# EAGLE design SkyKontrol-powerMeter (EAGLE 9.5.2)
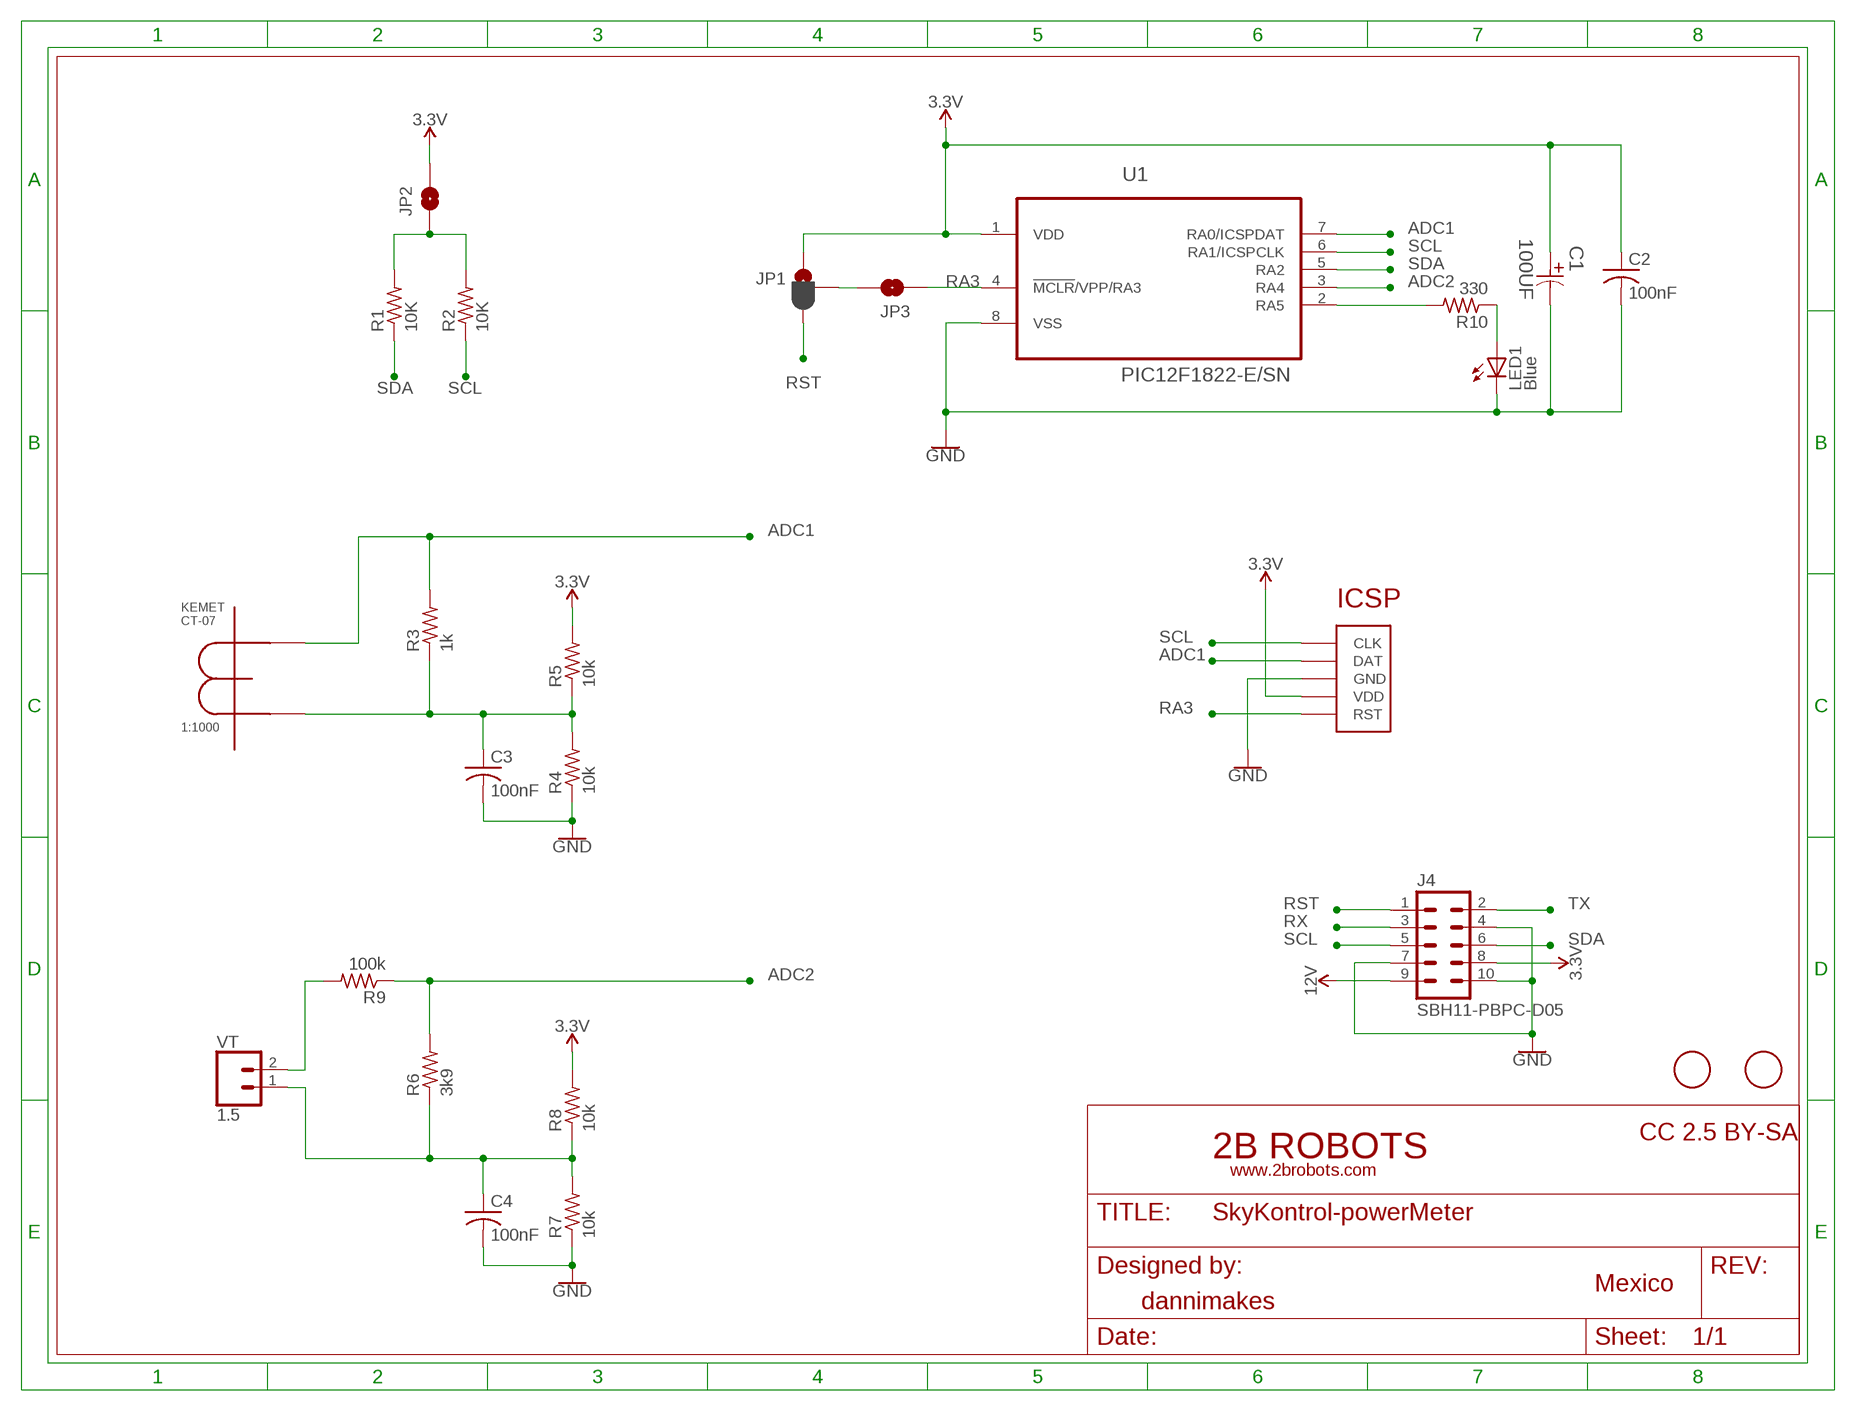
[diagram p0: schematic, sheet 1]

## Parts
C1  100UF  EEE-HA1E101XP-CASE-D8  [CAPAE660X800N]
C2  100nF  C-USC0603K  [C0603K]
C3  100nF  C-USC0603K  [C0603K]
C4  100nF  C-USC0603K  [C0603K]
J4  SBH11-PBPC-D05  [SBH11-PBPC-D05]
JP1  JUMPER-SMT_3_1-NC_PASTE_SILK  [SMT-JUMPER_3_1-NC_PASTE_SILK]
JP2  JUMPER-SMT_2_NO_SILK  [SMT-JUMPER_2_NO_SILK]
JP3  JUMPER-SMT_2_NO_SILK  [SMT-JUMPER_2_NO_SILK]
LED1  Blue  LEDCHIPLED_1206  [CHIPLED_1206]
R1  10K  R-US_R0805  [R0805]
R2  10K  R-US_R0805  [R0805]
R3  1k  R-US_R0805  [R0805]
R4  10k  R-US_R0805  [R0805]
R5  10k  R-US_R0805  [R0805]
R6  3k9  R-US_R0805  [R0805]
R7  10k  R-US_R0805  [R0805]
R8  10k  R-US_R0805  [R0805]
R9  100k  R-US_R0805  [R0805]
R10  330  R-US_R0805  [R0805]
U1  PIC12F1822-E/SN  [SOIC127P600X175-8N]
U$1  FIDUCIAL  [FIDUCIAL_1MM]
U$2  ICSP_POGO  [ICSP_POGO]
U$3  FIDUCIAL  [FIDUCIAL_1MM]
U$4  CT-07KEMET  [CT-07]
VT  1.5  CONN_025MM  [SCREWTERMINAL-5MM-2]

## Nets
3.3V: C1.1 C2.1 J4.8 JP1.1 JP2.2 R5.2 R8.2 U1.1(VDD) U$2.P$2(VDD)
12V: J4.9
ADC1: R3.2 U1.7(RA0/ICSPDAT) U$2.P$4(DAT) U$4.P$1(C1)
ADC2: R6.2 R9.1 U1.3(RA4)
GND: C1.2 C2.2 C3.2 C4.2 J4.4 J4.7 J4.10 LED1.C R4.1 R7.1 U1.8(VSS) U$2.P$3(GND)
N$1: JP1.2 JP3.2
N$2: C3.1 R3.1 R4.2 R5.1 U$4.P$2(C2)
N$3: R9.2 VT.2
N$4: C4.1 R6.1 R7.2 R8.1 VT.1
N$8: JP2.1 R1.2 R2.2
N$9: R10.2 U1.2(RA5)
N$10: LED1.A R10.1
RA3: JP3.1 U1.4(!MCLR!/VPP/RA3) U$2.P$1(RST)
RST: J4.1 JP1.3
RX: J4.3
SCL: J4.5 R2.1 U1.6(RA1/ICSPCLK) U$2.P$5(CLK)
SDA: J4.6 R1.1 U1.5(RA2)
TX: J4.2

## Library data of the parts
C1 = Panasonic-EEEFT_EEEH:EEE-: Aluminum Electrolytic Capacitors,Surface Mount Type; MPN: EEE-HA1E101XP; OC_FARNELL: 1973328; OC_NEWARK: 58T9236; PACKAGE: CASE-D8; SUPPLIER: PANASONIC; TOLERANCE: ±20 %; VOLTAGERATING: 25V
C2-C4 = adafruit:C-US: CAPACITOR, American symbol
J4 = con-sullins:SBH11-PBPC-D05: HEADER - Vertical, Shrouded
JP1 = SparkFun-Jumpers:JUMPER-SMT_3_1-NC_PASTE: Normally closed solder jumper (1 of 2 connections) This jumper has an aperture in the stencil to allow solder paste to bridge one of the two connections. One connection is normally closed (NC), while the other is normally open (NO). Wick off the solder to open the connection. Reapply solder to reclose the connection. Apply solder to the other side instead to change the current path.
JP2 JP3 = SparkFun-Jumpers:JUMPER-SMT_2_NO: Normally open jumper This jumper has two pads in close proximity to each other. Apply solder to close the connection. Round pads are easier to solder for beginners, but are a lot larger. SparkFun Product that uses the round pads: SparkFun EL Sequencer <https://www.sparkfun.com/products/12781>
LED1 = adafruit:LED: LED OSRAM: - CHIPLED LG R971, LG N971, LY N971, LG Q971, LY Q971, LO R971, LY R971 LH N974, LH R974 LS Q976, LO Q976, LY Q976 LO Q996 - Hyper CHIPLED LW Q18S LB Q993, LB Q99A, LB R99A - SideLED LS A670, LO A670, LY A670, LG A670, LP A670 LB A673, LV A673, LT A673, LW A673 LH A674 LY A675 LS A676, LA A676, LO A676, LY A676, LW A676 LS A679, LY A679, LG A679 - Hyper Micro SIDELED® LS Y876, LA Y876, LO Y876, LY Y876 LT Y87S - SmartLED LW L88C, LW L88S LB L89C, LB L89S, LG L890 LS L89K, LO L89K, LY L89K LS L896, LA L896, LO L896, LY L896 - TOPLED LS T670, LO T670, LY T670, LG T670, LP T670 LSG T670, LSP T670, LSY T670, LOP T670, LYG T670 LG T671, LOG T671, LSG T671 LB T673, LV T673, LT T673, LW T673 LH T674 LS T676, LA T676, LO T676, LY T676, LB T676, LH T676, LSB T676, LW T676 LB T67C, LV T67C, LT T67C, LS T67K, LO T67K, LY T67K, LW E67C LS E67B, LA E67B, LO E67B, LY E67B, LB E67C, LV E67C, LT E67C LW T67C LS T679, LY T679, LG T679 LS T770, LO T770, LY T770, LG T770, LP T770 LB T773, LV T773, LT T773, LW T773 LH T774 LS E675, LA E675, LY E675, LS T675 LS T776, LA T776, LO T776, LY T776, LB T776 LHGB T686 LT T68C, LB T68C - Hyper Mini TOPLED® LB M676 - Mini TOPLED Santana® LG M470 LS M47K, LO M47K, LY M47K Source: http://www.osram.convergy.de/
R1-R10 = adafruit:R-US_: RESISTOR, American symbol
U1 = Microchip-PIC12F1822-E_SN:PIC12F1822-E/SN: 8/14-Pin Flash Microcontrollers,SOIC-8; MPN: PIC12F1822-E/SN; OC_FARNELL: 2315760; OC_NEWARK: 53R0195; PACKAGE: SOIC-8; SUPPLIER: Microchip
U$1 U$3 = adafruit:FIDUCIAL: For use by pick and place machines to calibrate the vision/machine, 1mm By microbuilder.eu
U$2 = ICSP_POGO:ICSP_POGO
U$4 = CT-07:CT-07: The Kemet CT series low-alternating current sensors can be used to detect very low current levels and for overcurrent protection in electronic appliances. Typical applications include overcurrent detection in microcontroller-based equipment, refrigerators, air conditioners, inductive heating, servo motors, inverters, UPSs and SMPS.; CT-07: 1:1000
VT = SparkFun-Connectors:CONN_02: Multi connection point. Often used as Generic Header-pin footprint for 0.1 inch spaced/style header connections On any of the 0.1 inch spaced packages, you can populate with these: Break Away Headers - Straight <https://www.sparkfun.com/products/116> (PRT-00116) Break Away Male Headers - Right Angle <https://www.sparkfun.com/products/553> (PRT-00553) Female Headers <https://www.sparkfun.com/products/115> (PRT-00115) Break Away Headers - Machine Pin <https://www.sparkfun.com/products/117> (PRT-00117) Break Away Female Headers - Swiss Machine Pin <https://www.sparkfun.com/products/743> (PRT-00743) For SCREWTERMINALS and SPRING TERMINALS visit here: Screw Terimnals on SparkFun.com <https://www.sparkfun.com/search/results?term=Screw+Terminals> (5mm/3.5mm/2.54mm spacing) This device is also useful as a general connection point to wire up your design to another part of your project. Our various solder wires solder well into these plated through hole pads. Hook-Up Wire - Assortment (Stranded, 22 AWG) <https://www.sparkfun.com/products/11375> (PRT-11375) Hook-Up Wire - Assortment (Solid Core, 22 AWG) <https://www.sparkfun.com/products/11367> (PRT-11367) View the entire wire category on our website here <https://www.sparkfun.com/categories/141> Special notes: Molex polarized connector foot print use with: PRT-08233 with associated crimp pins and housings. 2.54_SCREWTERM for use with PRT-10571. 3.5mm Screw Terminal footprints for PRT-08084 5mm Screw Terminal footprints for use with PRT-08432; SF_SKU: PRT-08432

## Board
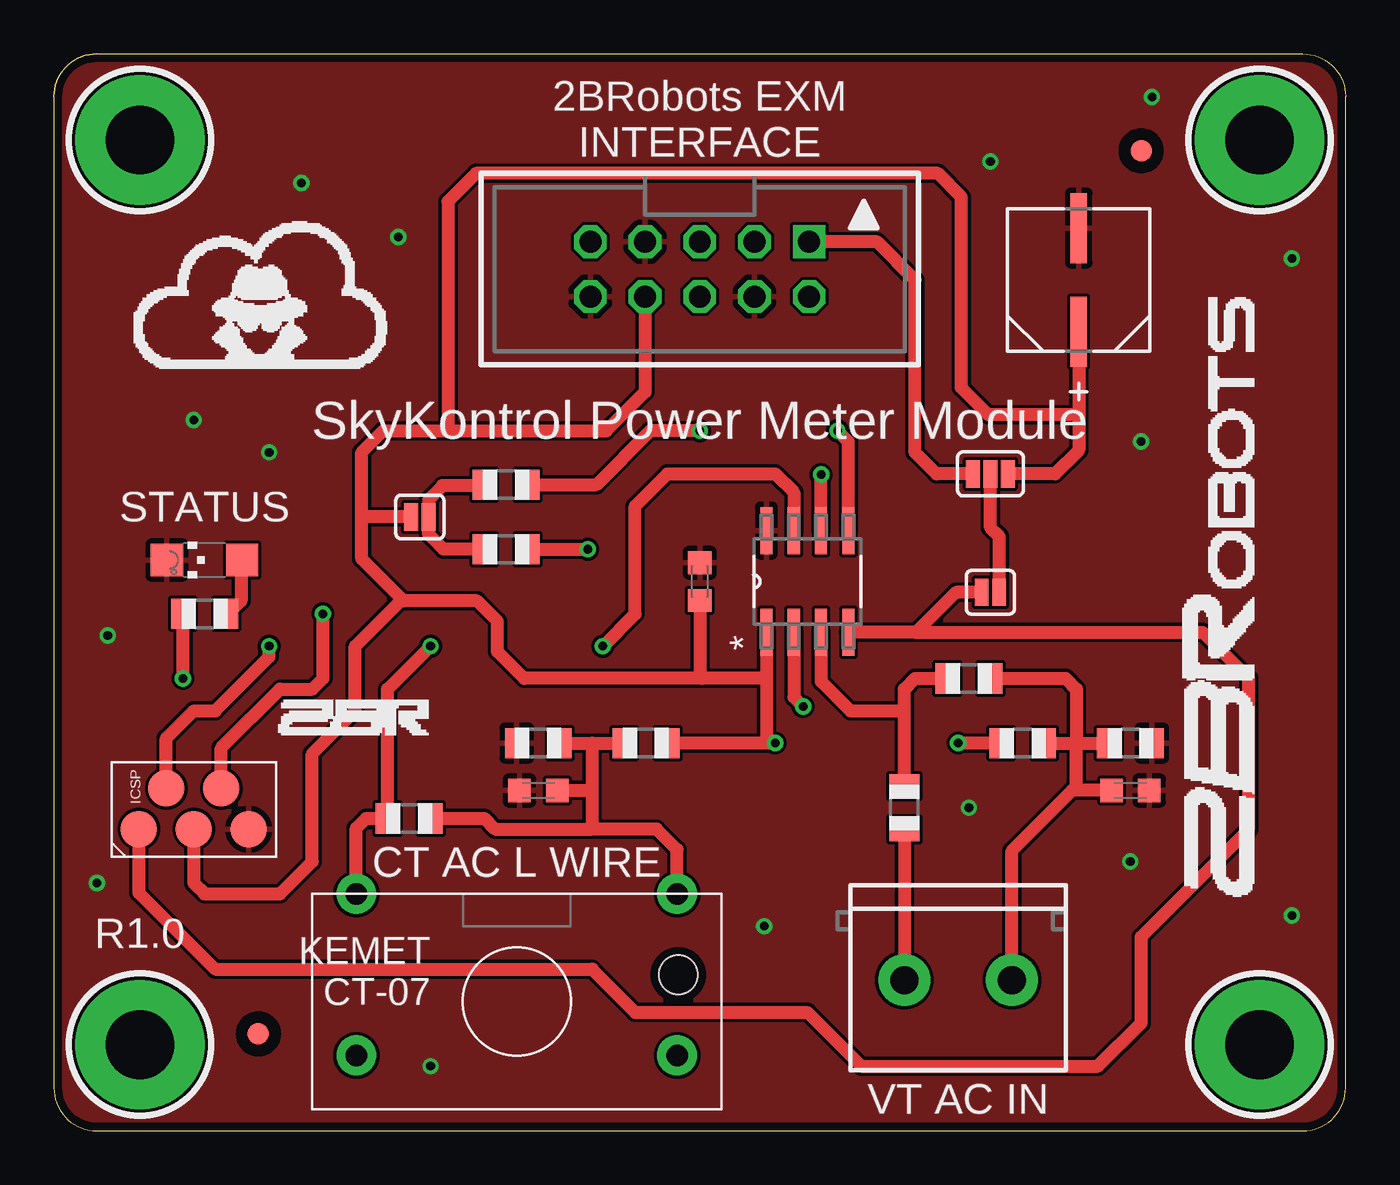
[diagram p1: board, top side]
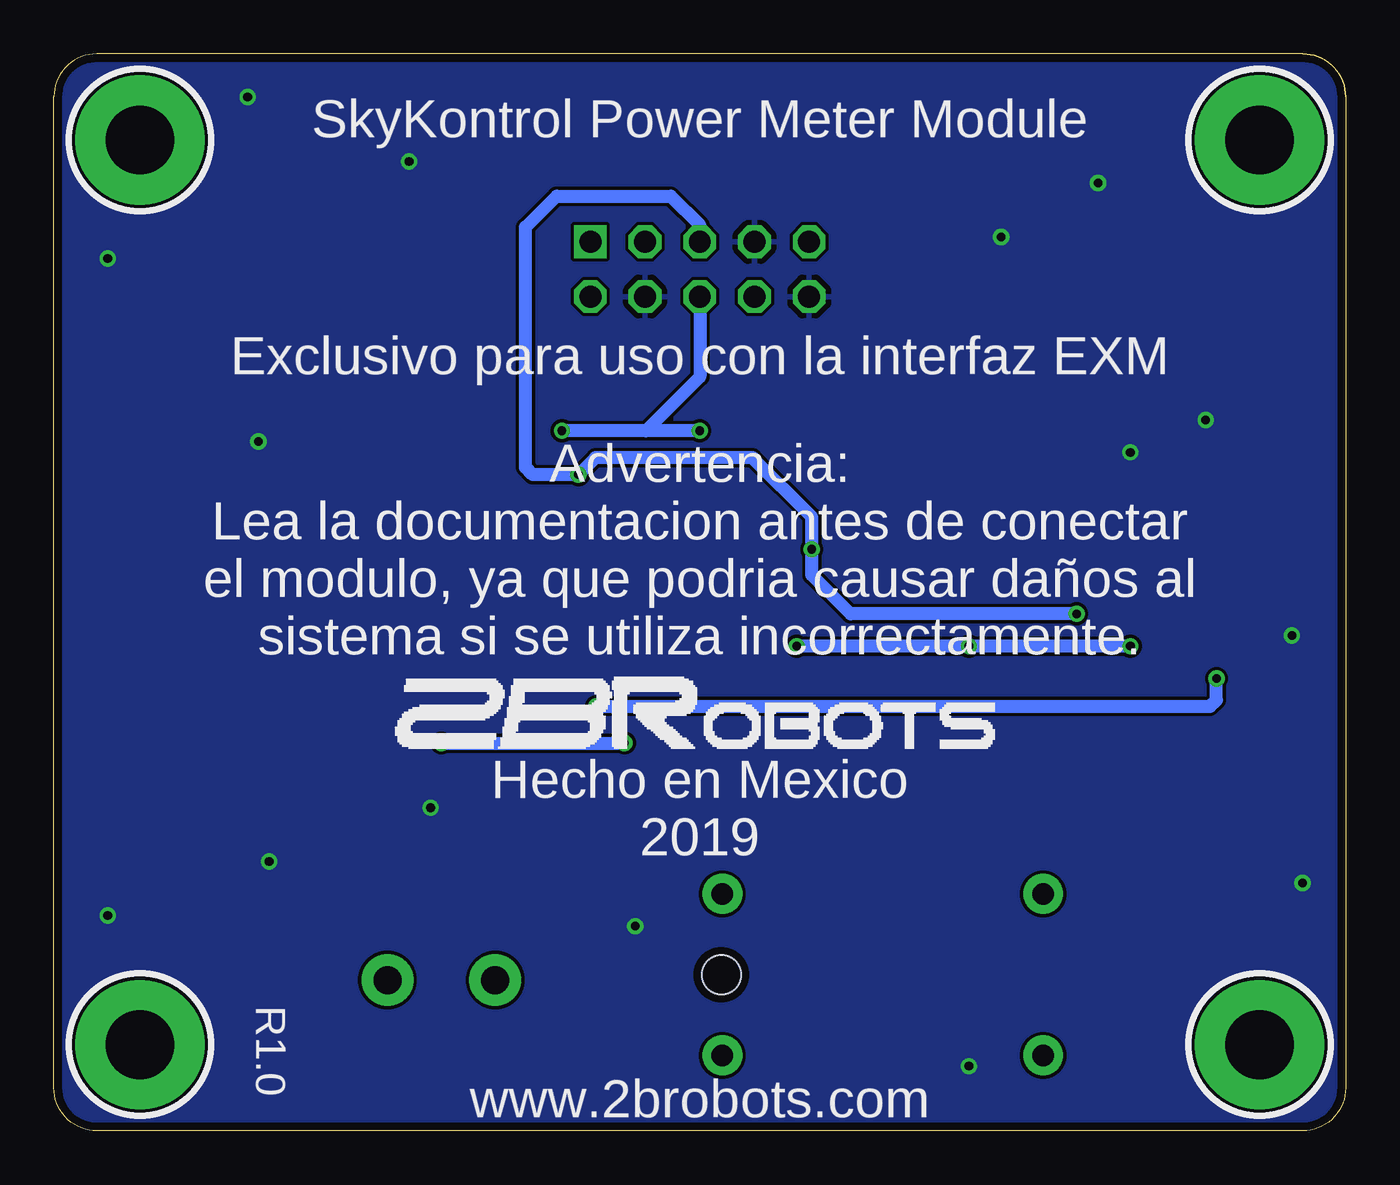
[diagram p2: board, bottom side, seen from below]

Size 60 x 50 mm. Coordinates in mm from the lower left corner, seen from the top.
Outline: 0,48 0,2 arc90 2,0 58,0 arc90 60,2 60,48 arc90 58,50 2,50
Outline: 2,50 arc90 0,48
Outline: 0,48 arc-90 2,50
Copper layers (1*16): Top 0.0356mm / dielectric 1.5011mm / Bottom 0.0356mm
Design rules "2brobots-2layer": minimum track width 6mil, minimum drill 0.3mm, track to track 6mil, track to pad 6mil, pad to pad 6mil, via to via 6mil, smd to smd 6mil, copper to edge 15mil, drill to drill 6mil, minimum pad ring 7mil, minimum via ring 7mil, stop-mask expansion 2.5mil, vias tented up to drill 50mil, thermal gap 10mil

### Footprints (pad centres in the part's own frame; a part is rotated, then mirrored left to right if it is on the bottom)
CAPAE660X800N = smd 3.251 x 0.762: 1 -2.413,0; 2 2.413,0
C0603K = smd 1.05 x 1.08: 1 -0.875,0; 2 0.875,0
SBH11-PBPC-D05 = drill 1.016 square: 1 -5.08,-1.27 | drill 1.016 octagon: 2 -5.08,1.27; 3 -2.54,-1.27; 4 -2.54,1.27; 5 0,-1.27; 6 0,1.27; 7 2.54,-1.27; 8 2.54,1.27; 9 5.08,-1.27; 10 5.08,1.27
SMT-JUMPER_3_1-NC_PASTE_SILK = smd 0.635 x 1.27: 1 -0.813,0; 2 0,0; 3 0.813,0
SMT-JUMPER_2_NO_SILK = smd 0.635 x 1.27: 1 -0.406,0; 2 0.406,0
CHIPLED_1206 = smd 1.5 x 1.5: A 0,-1.75; C 0,1.75
R0805 = smd 1.1 x 1.4: 1 -1,0; 2 1,0
SOIC127P600X175-8N = smd 2.184 x 0.559: 1 -2.362,1.905; 2 -2.362,0.635; 3 -2.362,-0.635; 4 -2.362,-1.905; 5 2.362,-1.905; 6 2.362,-0.635; 7 2.362,0.635; 8 2.362,1.905
FIDUCIAL_1MM = smd 1 x 1: 1 0,0
ICSP_POGO = smd 1.7 x 1.7: P$1 -2.55,0; P$2 0,0; P$3 2.55,0; P$4 -1.275,1.9; P$5 1.275,1.9
CT-07 = drill 1 pad 1.85: P$1 5,7.45; P$2 5,-7.45; P$3 -2.5,7.45; P$4 -2.5,-7.45 | hole 1.8: 1.25,-7.5
SCREWTERMINAL-5MM-2 = drill 1.3 pad 2.413: 1 -2.5,0; 2 2.5,0

### Placement (x,y rotation side)
C1  47.6,39.5 90 top
C2  30,25.5 90 top
C3  22.5,15.8 180 top
C4  50,15.8 0 top
J4  30,40 180 top
JP1  43.5,30.5 180 top
JP2  17,28.5 180 top
JP3  43.5,25 0 top
LED1  7,26.5 90 top
R1  21,30 180 top
R2  21,27 180 top
R3  16.5,14.5 180 top
R4  22.5,18 0 top
R5  27.5,18 0 top
R6  42.5,21 180 top
R7  50,18 180 top
R8  45,18 180 top
R9  39.5,15 270 top
R10  7,24 180 top
U1  35,25.5 90 top
U$1  9.5,4.5 0 top
U$2  6.5,14 0 top
U$3  50.5,45.5 0 top
U$4  21.5,6 90 top
VT  42,7 180 top

### Tracks (layer width: path | path; a pad name or v marks a point on that pad's centre or on a via)
3.3V  (via drill 0.4)
  Top 0.61: U1.1 33.09,21 | 33.09,21 33.09,18.09 33,18 | R8.2 v42,18 | v33.5,18 33,18 | 33,18 R5.2 | C1.1 47.6,33.25 | 47.6,33.25 47.6,31.6 46.5,30.5 JP1.1 | J4.8 27.46,34.31 25.65,32.5 18.2,32.5 | 18.2,32.5 15.3,32.5 14.3,31.5 14.3,28.5 | 33.09,21 30.1,21 | 30.1,21 21.85,21 20.6,22.25 20.6,23.65 19.65,24.6 16.25,24.6 | 16.25,24.6 14.3,26.55 14.3,28.5 | JP2.2 14.3,28.5 | 30.1,21 30,21.1 C2.1 | 47.6,33.25 43.4,33.25 42.15,34.5 42.15,43.35 41.05,44.45 19.6,44.45 18.3,43.15 18.3,32.6 18.2,32.5 | U$2.P$2 6.5,11.5 7,11 10.5,11 12,12.5 12,17.5 14,19.5 14,22.5 16.1,24.6 16.25,24.6
  Bottom 0.61: v42,18 v33.5,18
ADC1  (via drill 0.4)
  Top 0.61: U1.7 34.37,29.64 33.5,30.5 28.5,30.5 27,29 27,24 v25.5,22.5 | v17.5,22.5 15.5,20.5 R3.2 14.5,14.5 14.05,14.05 U$4.P$1 | U$2.P$4 5.22,18.23 6.5,19.5 7.5,19.5 10,22 v10,22.5
  Bottom 0.61: v25.5,22.5 25.5,22.55 25.45,22.5 v17.5,22.5 v10,22.5
ADC2
  Top 0.61: R9.1 39.5,19.5 | 39.5,19.5 39.5,20.5 40,21 R6.2 | U1.3 35.63,20.86 37,19.5 39.5,19.5
GND  (via drill 0.4)
  other vias: 11.5,44 57.5,40.5 33,9.5 2,11.5 2.5,23 6.5,33 42.5,15 50,12.5 57.5,10 50.5,32 51,48 43.5,45 16,41.5 10,31.5 17.5,3
  pour Top: 0,0 60,0 60,50 0,50
  pour Bottom: 0,0 60,0 60,50 0,50
N$1
  Top 0.61: JP3.2 43.91,27.59 43.5,28 JP1.2
N$2
  Top 0.61: 25,18 R5.1 | R4.2 25,18 | 25,18 25,15.8 | 25,15.8 25,14 | U$4.P$2 28.95,13.05 28,14 25,14 | R3.1 20,14.5 20.5,14 25,14 | C3.1 25,15.8
N$3
  Top 0.61: R9.2 39.5,7.04 VT.2
N$4
  Top 0.61: R8.1 47.5,18 | 47.5,18 R7.2 | R6.1 47,21 47.5,20.5 47.5,18 | 47.5,18 47.5,16 47.3,15.8 | C4.1 47.3,15.8 | VT.1 44.5,13 47.3,15.8
N$5  (via drill 3.2 pad 6)
  other vias: 56,46
N$6  (via drill 3.2 pad 6)
  other vias: 4,46
N$7  (via drill 3.2 pad 6)
  other vias: 4,4
N$8
  Top 0.61: R1.2 19.95,29.95 18.05,29.95 17.41,29.31 JP2.1 17.41,27.69 18.1,27 R2.2
N$9  (via drill 0.4)
  Top 0.61: U1.2 34.37,20.14 v34.8,19.7 | v6,21 R10.2
  Bottom 0.61: v6,21 6,20 6.3,19.7 v34.8,19.7
N$10
  Top 0.61: LED1.A 8.7,26.35 8.7,24.6 8.2,24.1 R10.1
N$11  (via drill 3.2 pad 6)
  other vias: 56,4
RA3
  Top 0.61: JP3.1 41.9,25 40.04,23.14 | 40.04,23.14 U1.4 | U$2.P$1 3.95,11.05 7.5,7.5 25,7.5 27,5.5 35,5.5 37.5,3 48.5,3 50.5,5 50.5,9 55.5,14 55.5,21 53.36,23.14 40.04,23.14
RST
  Top 0.61: JP1.3 41,30.5 40,31.5 40,39.5 38.23,41.27 J4.1
SCL  (via drill 0.4)
  Top 0.61: U1.6 v35.63,30.46 | R2.1 v24.8,27 | U$2.P$5 7.78,17.77 10.5,20.5 12,20.5 12.5,21 v12.5,24
  Bottom 0.61: J4.5 30,42.05 31.35,43.4 36.65,43.4 38.1,41.95 38.1,30.8 37.77,30.46 v35.63,30.46 34.85,31.25 27.55,31.25 24.8,28.5 v24.8,27 24.8,25.8 23,24 v12.5,24
SDA  (via drill 0.4)
  Top 0.61: U1.5 36.91,32 v36.4,32.5 | R1.1 25.2,30 27.7,32.5 v30,32.5
  Bottom 0.61: J4.6 30,35 32.5,32.5 | 32.5,32.5 v36.4,32.5 | v30,32.5 32.5,32.5

### Text on the board
tPlace: 2BRobots EXM / INTERFACE | SkyKontrol Power Meter Module | STATUS | CT AC L WIRE | R1.0 | VT AC IN
bPlace: SkyKontrol Power Meter Module | Exclusivo para uso con la interfaz EXM | Advertencia: / Lea la documentacion antes de conectar / el modulo, ya que podria causar daños al / sistema si se utiliza incorrectamente. | Hecho en Mexico / 2019 | R1.0 | www.2brobots.com
tStop: www.2brobots.com